# Altium schematic sheet ADC_CPU.SchDoc: ADC CPU
size Tabloid; Date: 06/01/2023; Engineer: Terry D. Schevker; Revision: 1.0; SheetNumber: 3; SheetTotal: 7
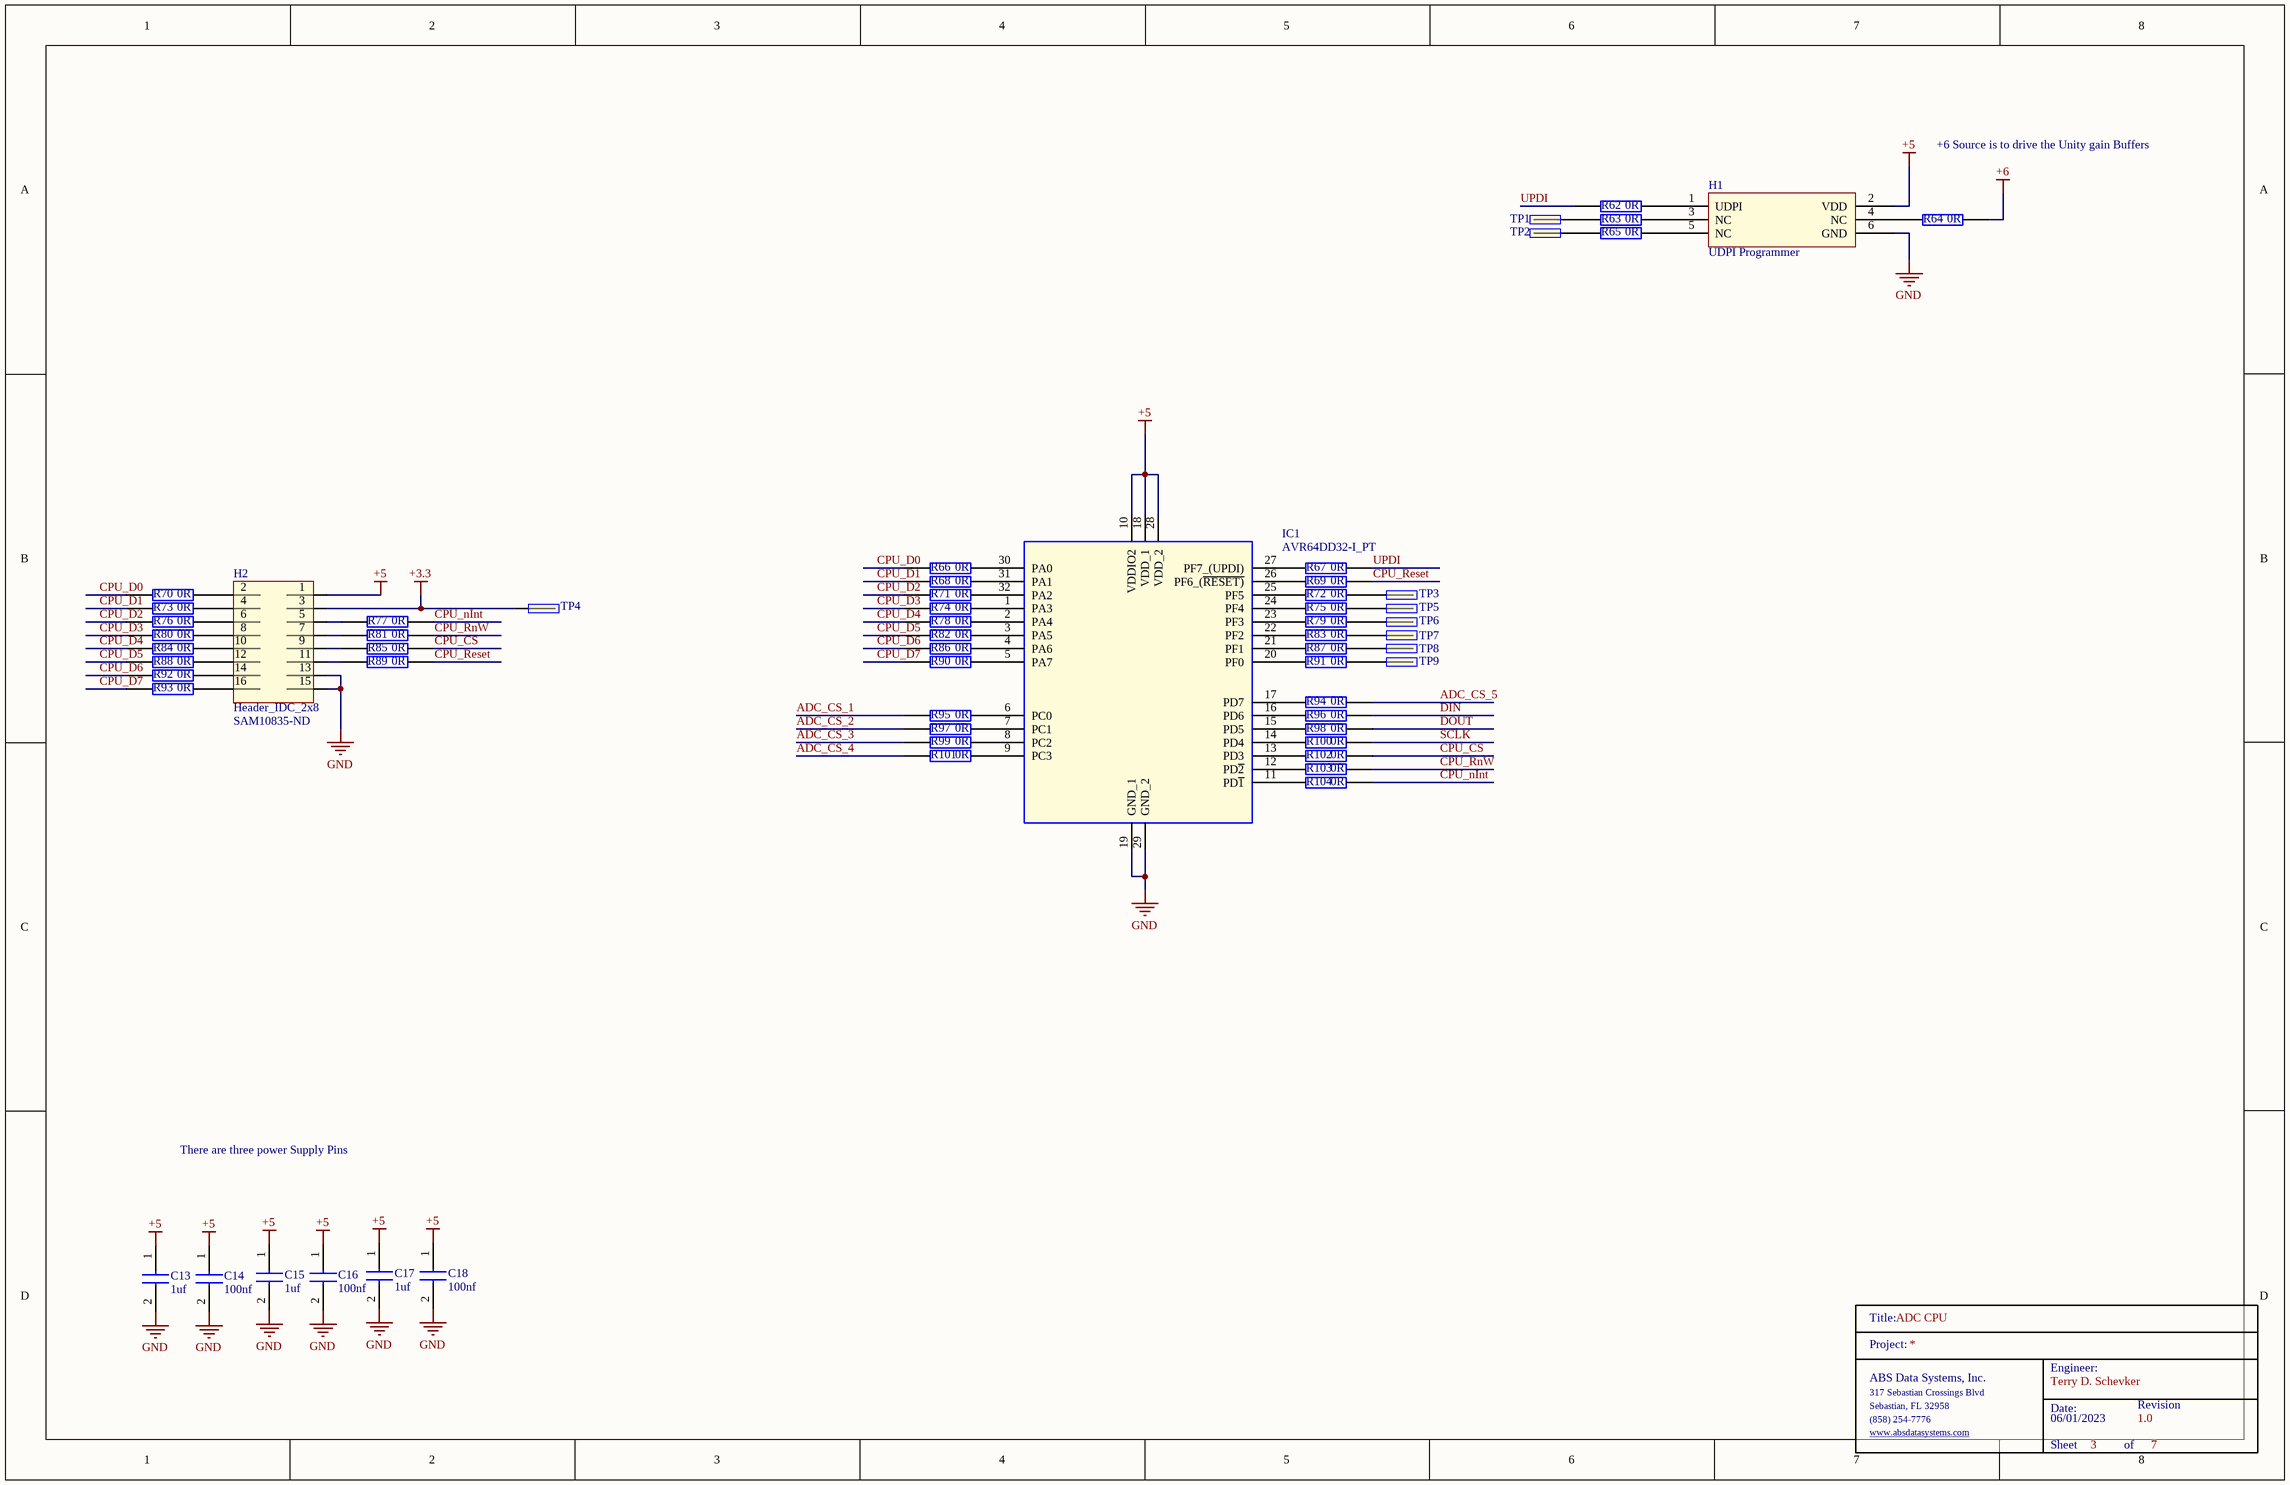
[diagram p0: ADC_CPU.SchDoc]

## Parts
C13  1uf  [0603]
C14  100nf  [0603]
C15  1uf  [0603]
C16  100nf  [0603]
C17  1uf  [0603]
C18  100nf  [0603]
H1  UDPI Programmer  [HDR2X3]
H2  Header_IDC_2x8  Supplier Part Number 1: SAM10835-ND  [HEADER16]
IC1  AVR64DD32-I_PT  [QFP80P900X900X120-32N]
R62  0R  [0603]
R63  0R  [0603]
R64  0R  [0603]
R65  0R  [0603]
R66  0R  [0603]
R67  0R  [0603]
R68  0R  [0603]
R69  0R  [0603]
R70  0R  [0603]
R71  0R  [0603]
R72  0R  [0603]
R73  0R  [0603]
R74  0R  [0603]
R75  0R  [0603]
R76  0R  [0603]
R77  0R  [0603]
R78  0R  [0603]
R79  0R  [0603]
R80  0R  [0603]
R81  0R  [0603]
R82  0R  [0603]
R83  0R  [0603]
R84  0R  [0603]
R85  0R  [0603]
R86  0R  [0603]
R87  0R  [0603]
R88  0R  [0603]
R89  0R  [0603]
R90  0R  [0603]
R91  0R  [0603]
R92  0R  [0603]
R93  0R  [0603]
R94  0R  [0603]
R95  0R  [0603]
R96  0R  [0603]
R97  0R  [0603]
R98  0R  [0603]
R99  0R  [0603]
R100  0R  [0603]
R101  0R  [0603]
R102  0R  [0603]
R103  0R  [0603]
R104  0R  [0603]
TitleBlock_3  TitleBlock  (value not drawn)  (graphical)
TP1  TP  [TP]  (value not drawn)
TP2  TP  [TP]  (value not drawn)
TP3  TP  [TP]  (value not drawn)
TP4  TP  [TP]  (value not drawn)
TP5  TP  [TP]  (value not drawn)
TP6  TP  [TP]  (value not drawn)
TP7  TP  [TP]  (value not drawn)
TP8  TP  [TP]  (value not drawn)
TP9  TP  [TP]  (value not drawn)

## Nets
+3.3: H2.3 TP4.1
+5: C13.1 C14.1 C15.1 C16.1 C17.1 C18.1 H1.2(VDD) H2.1 IC1.10(VDDIO2) IC1.18(VDD_1) IC1.28(VDD_2)
+6: R64.2
GND: C13.2 C14.2 C15.2 C16.2 C17.2 C18.2 H1.6(GND) H2.13 H2.15 IC1.19(GND_1) IC1.29(GND_2)
ADC_CS_1: R95.1
ADC_CS_2: R97.1
ADC_CS_3: R99.1
ADC_CS_4: R101.1
ADC_CS_5: R94.2
CPU_CS: R85.2 R102.2
CPU_D0: R66.1 R70.1
CPU_D1: R68.1 R73.1
CPU_D2: R71.1 R76.1
CPU_D3: R74.1 R80.1
CPU_D4: R78.1 R84.1
CPU_D5: R82.1 R88.1
CPU_D6: R86.1 R92.1
CPU_D7: R90.1 R93.1
CPU_nInt: R77.2 R104.2
CPU_Reset: R69.2 R89.2
CPU_RnW: R81.2 R103.2
DIN: R96.2
DOUT: R98.2
SCLK: R100.2
UPDI: R62.1 R67.2
NetH1_1: H1.1(UDPI) R62.2
NetH1_3: H1.3(NC) R63.2
NetH1_4: H1.4(NC) R64.1
NetH1_5: H1.5(NC) R65.2
NetH2_2: H2.2 R70.2
NetH2_4: H2.4 R73.2
NetH2_5: H2.5 R77.1
NetH2_6: H2.6 R76.2
NetH2_7: H2.7 R81.1
NetH2_8: H2.8 R80.2
NetH2_9: H2.9 R85.1
NetH2_10: H2.10 R84.2
NetH2_11: H2.11 R89.1
NetH2_12: H2.12 R88.2
NetH2_14: H2.14 R92.2
NetH2_16: H2.16 R93.2
NetIC1_1: IC1.1(PA3) R74.2
NetIC1_2: IC1.2(PA4) R78.2
NetIC1_3: IC1.3(PA5) R82.2
NetIC1_4: IC1.4(PA6) R86.2
NetIC1_5: IC1.5(PA7) R90.2
NetIC1_6: IC1.6(PC0) R95.2
NetIC1_7: IC1.7(PC1) R97.2
NetIC1_8: IC1.8(PC2) R99.2
NetIC1_9: IC1.9(PC3) R101.2
NetIC1_11: IC1.11(PD~{1}) R104.1
NetIC1_12: IC1.12(PD~{2}) R103.1
NetIC1_13: IC1.13(PD3) R102.1
NetIC1_14: IC1.14(PD4) R100.1
NetIC1_15: IC1.15(PD5) R98.1
NetIC1_16: IC1.16(PD6) R96.1
NetIC1_17: IC1.17(PD7) R94.1
NetIC1_20: IC1.20(PF0) R91.1
NetIC1_21: IC1.21(PF1) R87.1
NetIC1_22: IC1.22(PF2) R83.1
NetIC1_23: IC1.23(PF3) R79.1
NetIC1_24: IC1.24(PF4) R75.1
NetIC1_25: IC1.25(PF5) R72.1
NetIC1_26: IC1.26(PF6_(~{RESET)}) R69.1
NetIC1_27: IC1.27(PF7_(UPDI)) R67.1
NetIC1_30: IC1.30(PA0) R66.2
NetIC1_31: IC1.31(PA1) R68.2
NetIC1_32: IC1.32(PA2) R71.2
NetR63_1: R63.1 TP1.1
NetR65_1: R65.1 TP2.1
NetR72_2: R72.2 TP3.1
NetR75_2: R75.2 TP5.1
NetR79_2: R79.2 TP6.1
NetR83_2: R83.2 TP7.1
NetR87_2: R87.2 TP8.1
NetR91_2: R91.2 TP9.1

## Notes on the sheet
- +6 Source is to drive the Unity gain Buffers
- There are three power Supply Pins
- (in symbol TitleBlock) Title:; Project:; Engineer:; ABS Data Systems, Inc.; 317 Sebastian Crossings Blvd; Sebastian, FL 32958; Date:; Revision; (858) 254-7776; www.absdatasystems.com; Sheet; of

## Library data of the parts
C13 C15 C17 = CL10B105KA8NNNL: Samsung Electro-Mechanics 0603 1uf
C14 C16 C18 = CL10B104JB8NNNC: Samsung Electro-Mechanics 0603 100nf
H1 = UDPI Programmer: 6 Pin 2X3 Through Hole Header
H2 = Header_IDC_2x8: 16 Pin 2x8 Through Hold IDC Connector; Manufacturer: Samtec; Manufacturer Part Number: TST-108-01-G-D; Number of Contacts: 16; Gender: Male; Connector Type: Male Pin; Pitch: 2.54mm; Row Spacing: 0.1inch; Supplier 1: Digi-Key; RoHS: Yes; Category: Headers and Wire Housings; Stock 1: 227; Pricing 1: 1=2.85000, 10=2.73600, 100=2.28000, 500=1.93800, 1000=1.65300, 5000=1.48200 (USD); Mount: Through Hole; Contact Plating: Gold; Contact Material: Bronze; Housing Material: Polyester; Housing Color: Black; Color: Black; Min Operating Temperature: -55°C; Max Operating Temperature: 125°C; Number of Rows: 2; Termination: Solder; Packaging: Rail/Tube; Orientation: Straight; Number of Positions: 16; Length: 27.94mm; Depth: 9.27mm; Contact Mating Length: 0.25inch; REACH SVHC: No SVHC; ComponentLink1URL: https://datasheet.ciiva.com/739/tst-mkt-739845.pdf?src-supplier=Digi-Key; ComponentLink1Description: https://datasheet.ciiva.com/739/tst-mkt-739845.pdf?src-supplier=Digi-Key; ComponentLink2URL: https://datasheet.ciiva.com/10018/htst-10018510.pdf?src-supplier=Avnet; ComponentLink2Description: https://datasheet.ciiva.com/10018/htst-10018510.pdf?src-supplier=Avnet
IC1 = AVR64DD32-I_PT: Integrated Circuit; Manufacturer_Name: Microchip; Manufacturer_Part_Number: AVR64DD32-I/PT | MULTI-VOLTAGE I/O; Datasheet Link: https://www.microchip.com/en-us/product/AVR64DD32; Height: 1.2mm
R62-R104 = RC0603JR-070RL: YAGEO 0603 0 ohm; Manufacturer_Name: KEMET; Geometry.Height: 0.55mm; Mouser Part Number: 603-RC0603JR-070RL; Mouser Price/Stock: https://www.mouser.co.uk/ProductDetail/YAGEO/RC0603JR-070RL?qs=2cAdsCoAWRGWyPcuXgGiXQ%3D%3D; Manufacturer_Part_Number: RC0603JR-070RL; Datasheet Link: https://datasheet.datasheetarchive.com/originals/distributors/Datasheets_SAMA/902f9e387b938f871d31120f5fc1d65e.pdf
TP1-TP9 = TP: Manufacturer: Samtec; Manufacturer Part Number: TST-105-01-G-D; Number of Contacts: 16; Gender: Male; Connector Type: Male Pin; Pitch: 2.54mm; Row Spacing: 0.1inch; Supplier 1: Digi-Key; RoHS: Yes; Category: Headers and Wire Housings; Stock 1: 227; Pricing 1: 1=2.85000, 10=2.73600, 100=2.28000, 500=1.93800, 1000=1.65300, 5000=1.48200 (USD); Mount: Through Hole; Contact Plating: Gold; Contact Material: Bronze; Housing Material: Polyester; Housing Color: Black; Color: Black; Min Operating Temperature: -55°C; Max Operating Temperature: 125°C; Number of Rows: 2; Termination: Solder; Packaging: Rail/Tube; Orientation: Straight; Number of Positions: 16; Length: 27.94mm; Depth: 9.27mm; Contact Mating Length: 0.25inch; REACH SVHC: No SVHC; ComponentLink1URL: https://datasheet.ciiva.com/739/tst-mkt-739845.pdf?src-supplier=Digi-Key; ComponentLink1Description: https://datasheet.ciiva.com/739/tst-mkt-739845.pdf?src-supplier=Digi-Key; ComponentLink2URL: https://datasheet.ciiva.com/10018/htst-10018510.pdf?src-supplier=Avnet; ComponentLink2Description: https://datasheet.ciiva.com/10018/htst-10018510.pdf?src-supplier=Avnet